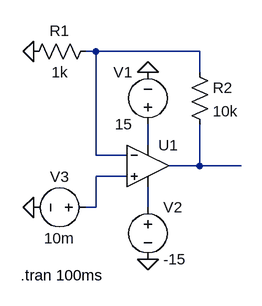
[diagram p0: schematic current_gain.asc]
current_gain.asc, the LTspice schematic file:
Version 4
SHEET 1 880 680
WIRE 64 0 48 0
WIRE 224 0 64 0
WIRE 224 32 224 0
WIRE 144 144 144 112
WIRE 64 160 64 0
WIRE 112 160 64 160
WIRE 224 176 224 112
WIRE 224 176 176 176
WIRE 288 176 224 176
WIRE 112 192 64 192
WIRE 64 240 64 192
WIRE 64 240 48 240
WIRE 144 240 144 208
FLAG -32 240 0
FLAG 144 320 0
FLAG 144 32 0
FLAG -32 0 0
SYMBOL Opamps\\UniversalOpamp2 144 176 R0
SYMATTR InstName U1
SYMBOL voltage 144 128 R180
WINDOW 0 24 96 Left 2
WINDOW 3 24 16 Left 2
WINDOW 123 0 0 Left 2
WINDOW 39 0 0 Left 2
SYMATTR InstName V1
SYMATTR Value 15
SYMBOL voltage 144 224 R0
WINDOW 123 0 0 Left 2
WINDOW 39 0 0 Left 2
SYMATTR InstName V2
SYMATTR Value -15
SYMBOL voltage 64 240 R90
WINDOW 0 -32 56 VBottom 2
WINDOW 3 32 56 VTop 2
WINDOW 123 0 0 Left 2
WINDOW 39 0 0 Left 2
SYMATTR InstName V3
SYMATTR Value 10m
SYMBOL res -48 16 R270
WINDOW 0 32 56 VTop 2
WINDOW 3 0 56 VBottom 2
SYMATTR InstName R1
SYMATTR Value 1k
SYMBOL res 208 16 R0
SYMATTR InstName R2
SYMATTR Value 10k
TEXT -52 344 Left 2 !.tran 100ms

The netlist it stands for:
* current_gain.asc
XU1 N004 N001 N002 N005 N003 level.2 Avol=1Meg GBW=10Meg Slew=10Meg ilimit=25m rail=0 Vos=0 phimargin=45 en=0 enk=0 in=0 ink=0 Rin=500Meg  ; pins IN+ IN- V+ V- OUT
V1 N002 0 15
V2 N005 0 -15
V3 N004 0 10m
R1 0 N001 1k
R2 N001 N003 10k
.tran 100ms
.lib UniversalOpamps2.sub
.backanno
.end